# Altium schematic sheet PowerConnector.SchDoc
size A4; SheetNumber: 2; SheetTotal: 5
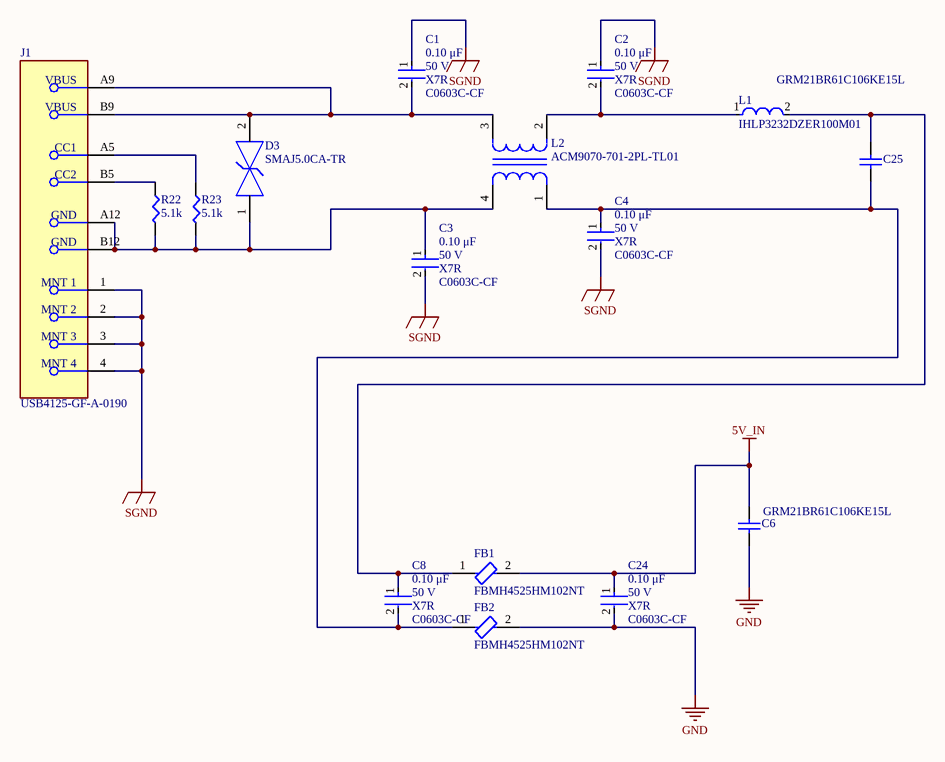
[diagram p0: PowerConnector.SchDoc]

## Parts
C1  value 0.10 μF  Package: C0603C-CF  Voltage Rating: 50 V  Temperature Characteristic: X7R  [FP-C0603C-CF-MFG]  (hidden comment: C0603C104K5RACTU)
C2  value 0.10 μF  Package: C0603C-CF  Voltage Rating: 50 V  Temperature Characteristic: X7R  [FP-C0603C-CF-MFG]  (hidden comment: C0603C104K5RACTU)
C3  value 0.10 μF  Package: C0603C-CF  Voltage Rating: 50 V  Temperature Characteristic: X7R  [FP-C0603C-CF-MFG]  (hidden comment: C0603C104K5RACTU)
C4  value 0.10 μF  Package: C0603C-CF  Voltage Rating: 50 V  Temperature Characteristic: X7R  [FP-C0603C-CF-MFG]  (hidden comment: C0603C104K5RACTU)
C6  GRM21BR61C106KE15L  [CAPC2013X135X50LL10T20]
C8  value 0.10 μF  Package: C0603C-CF  Voltage Rating: 50 V  Temperature Characteristic: X7R  [FP-C0603C-CF-MFG]  (hidden comment: C0603C104K5RACTU)
C24  value 0.10 μF  Package: C0603C-CF  Voltage Rating: 50 V  Temperature Characteristic: X7R  [FP-C0603C-CF-MFG]  (hidden comment: C0603C104K5RACTU)
C25  GRM21BR61C106KE15L  [CAPC2013X135X50LL10T20]
D3  SMAJ5.0CA-TR  [FP-SMA-MFG]
FB1  FBMH4525HM102NT  [FP-FBMH4525-MFG]
FB2  FBMH4525HM102NT  [FP-FBMH4525-MFG]
J1  USB4125-GF-A-0190  [FP-USB4125-GF-A-0190-MFG]
L1  IHLP3232DZER100M01  [FP-IHLP-3232DZ-FP_2_413x5-MFG]
L2  ACM9070-701-2PL-TL01  [FP-ACM9070-MFG]
R22  5.1k  [SMD-0603-RES]
R23  5.1k  [SMD-0603-RES]

## Nets
5V_IN: C6.2 C24.1 FB1.2
GND: C6.1 C24.2 FB2.2
SGND: C1.1 C2.1 C3.2 C4.2 J1.1(MNT_1) J1.2(MNT_2) J1.3(MNT_3) J1.4(MNT_4)
NetC1_2: C1.2 D3.2 J1.A9(VBUS) J1.B9(VBUS) L2.3
NetC2_2: C2.2 L1.1 L2.2
NetC3_1: C3.1 D3.1 J1.A12(GND) J1.B12(GND) L2.4 R22.2 R23.2
NetC4_1: C4.1 C8.2 C25.1 FB2.1 L2.1
NetC8_1: C8.1 C25.2 FB1.1 L1.2
NetJ1_A5: J1.A5(CC1) R23.1
NetJ1_B5: J1.B5(CC2) R22.1

## Library data of the parts
C1-C4 C8 C24 = CMP-2006-03061-2: CAP CER 0.1UF 50V X7R 0603; Manufacturer: KEMET; Tolerance: 0.1; Temperature Coefficient: 30ppm/°C; Material: Ceramic; Automotive Grade: Grade 1; Temperature: -55°C to +125°C; RoHS: TRUE; Temperature Range High: +125°C; Lead Free: Yes; Octopart: https://octopart.com/c0603c104k5ractu-kemet-139244; Digikey Description: CAP CER 0.1UF 50V X7R 0603; Category: Cap; ComponentLink2Description: Datasheet; Temperature Range Low: -55°C; Device Class L1: Passive Components; Automotive: Yes; Device Class L3: Ceramic Capacitors; ComponentLink2URL: https://api.kemet.com/component-edge/download/datasheet/C0603C100J5GACAUTO.pdf; Capacitance: 0.10 μF; Device Class L2: Capacitors; Manufacturer Part Number: C0603C104K5RACTU; Height: 0.87mm
C6 C25 = CMP-2007-03453-1: Manufacturer: Murata; Part Number: GRM21BR61C106KE15L
D3 = CMP-12225-000029-1: TVS DIODE 5V 13.4V SMA; Manufacturer: STMicroelectronics; Peak Pulse Power: 400W; Breakdown Voltage: 6.4V; Number Of Channels: 1; Clamping Voltage: 9.2V; Standoff Height: 0.05mm; Peak Pulse Current: 43.5A; Max Junction Temp: +150°C; Direction: Bidirectional; Height: 2.65mm; ComponentLink2Description: Datasheet; ComponentLink2URL: https://www.st.com/resource/en/datasheet/smaj.pdf; Temperature: -55°C to +150°C; Temperature Range High: +150°C; Digikey Description: TVS DIODE 5V 13.4V SMA; Device Class L1: Circuit Protection; Package: SMA; Octopart: https://octopart.com/smaj5.0ca-tr-stmicroelectronics-350177; Mouser Description: TVS Diodes - Transient Voltage Suppressors 400W 5.0V Bidirect; Temperature Range Low: -55°C; Category: Diode; Device Class L3: unset; Device Class L2: TVS Diodes; Lead Free: Yes; Automotive: No; Reverse Standoff Voltage: 5V; Manufacturer Part Number: SMAJ5.0CA-TR; RoHS: TRUE
FB1 FB2 = CMP-14488-000004-1: FERRITE BEAD 1 KOHM 1810 1LN; Manufacturer: Taiyo Yuden; Series Resistance: 0.06Ω; Impedance At Frequency: 1000Ω @ 100MHz; Tolerance: 30%; Rms Current: 3A; Device Class L2: EMI / RFI Components; Ipc Land Pattern Name: CAPC450250X250; Lead Free: Yes; ComponentLink2Description: Datasheet; RoHS: TRUE; Temperature: -40°C to +125°C; Device Class L1: Passive Components; Manufacturer Part Number: FBMH4525HM102NT; Mouser Description: Ferrite Beads HI CUR CHIP BD 1810 1000OHMS 30%; Height: 2.8mm; Digikey Description: FERRITE BEAD 1 KOHM 1810 1LN; Automotive: No; ComponentLink2URL: https://www.yuden.co.jp/productdata/catalog/chipbeads01_e.pdf; Category: FBead; Package: FBMH4525; Device Class L3: Ferrite Beads and Chips; Temperature Range Low: -40°C; Octopart: https://octopart.com/fbmh4525hm102nt-taiyo+yuden-368416; Temperature Range High: +125°C; Core Material: Ferrite
J1 = CMP-245163-000004-1: CONN RCPT TYPE C 6P SMD RA
L1 = CMP-02424-000288-1: FIXED IND 10UH 5.2A 59.9 MOHM; Inductance Tolerance: 20%; Core Material: Metal; Saturation Current: 9A; Self Resonant Frequency: 15MHz; Shielding: Shielded; Test Frequency: 100kHz; DC Resistance (DCR): 59.9mR; Radiation Hardening: No; Termination: SMD/SMT; Height - Seated (Max): 0.157inch; Height: 4mm; Lead Free: Lead Free; Min Operating Temperature: -55°C; Width: 0.322inch; Package Quantity: 500; Military Standard: Not; Length: 8.64mm; RMS Current (Irms): 5.2A; Mount: Surface Mount; Current Rating: 5.2A; Max Operating Temperature: 125°C; Number of Pins: 2; Inductance: 10uH; Depth: 8.26mm; Packaging: Tape and Reel; Max DC Current: 5.2A; Case/Package: 3232; Tolerance: 20%
L2 = CMP-08256-000018-1: CMC 5A 2LN 700 OHM SMD; Test Frequency: 100MHz; Impedance: 700R; Element Configuration: Dual; Voltage Rating (DC): 80V; Number of Lines: 2; DC Resistance (DCR): 10mR; Shielding: Unshielded; Depth: 7.2mm; DC Current: 5A; Max DC Current: 5A; Radiation Hardening: No; Packaging: Tape and Reel; Current Rating: 5A; Max Operating Temperature: 85°C; Number of Pins: 4; Lead Free: Lead Free; Length: 9.2mm; Width: 7mm; Min Operating Temperature: -40°C; Package Quantity: 1; Height: 4.5mm; Case/Package: 3628; Series: ACM; REACH SVHC: No SVHC; Mount: Surface Mount; Current: 5A; Termination: SMD/SMT; Insulation Resistance: 10MR; RoHS Compliant: Yes
R22 R23 = ERJ-3EKF5101V: RES SMD 5.1K OHM 1% 1/10W 0603; Manufacturer: Panasonic Electronic Components; Factory Stock: 0; Unit Price (USD): 0.00379; @ qty: 1500; Minimum Quantity: 1; Power (Watts): 0.1W, 1/10W; Temperature Coefficient: ±100ppm/°C; Part Number: ERJ-3EKF5101V; Datasheets: http://industrial.panasonic.com/www-cgi/jvcr13pz.cgi?E+PZ+3+AOA0002+ERJ3EKF5101V+7+WW; Image: //media.digikey.com/Photos/Panasonic%20Photos/MFG_ERJ-P6W%20Series.jpg; Digi-Key Part Number: P5.10KHCT-ND; Quantity Available: 159646; Packaging: Cut Tape (CT); Series: ERJ; Part Status: Active; Value: 5.1k; Tolerance: ±1%; Composition: Thick Film; Features: Automotive AEC-Q200; Operating Temperature: -55°C ~ 155°C; Package / Case: 0603 (1608 Metric); Supplier Device Package: 0603; Size / Dimension: 0.063" L x 0.031" W (1.60mm x 0.80mm); Height - Seated (Max): 0.022" (0.55mm); Number of Terminations: 2; Failure Rate: -